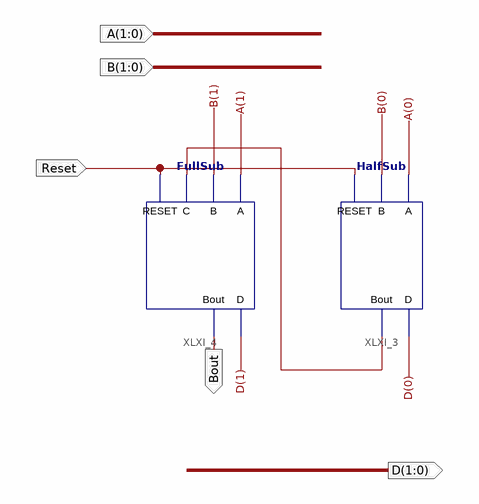
[diagram p0: schematic sheet 1]
// Xilinx ISE schematic Bit2Sub.sch (artix7) as structural Verilog: 2 symbols, 5 ports
module Bit2Sub (
  input  Reset,
  input  [1:0] A,
  input  [1:0] B,
  output Bout,
  output [1:0] D
);

  wire XLXN_1;

  HalfSub XLXI_3 (.A(A[0]), .B(B[0]), .Bout(XLXN_1), .D(D[0]), .RESET(Reset));
  FullSub XLXI_4 (.A(A[1]), .B(B[1]), .Bout(Bout), .C(XLXN_1), .D(D[1]), .RESET(Reset));
endmodule
